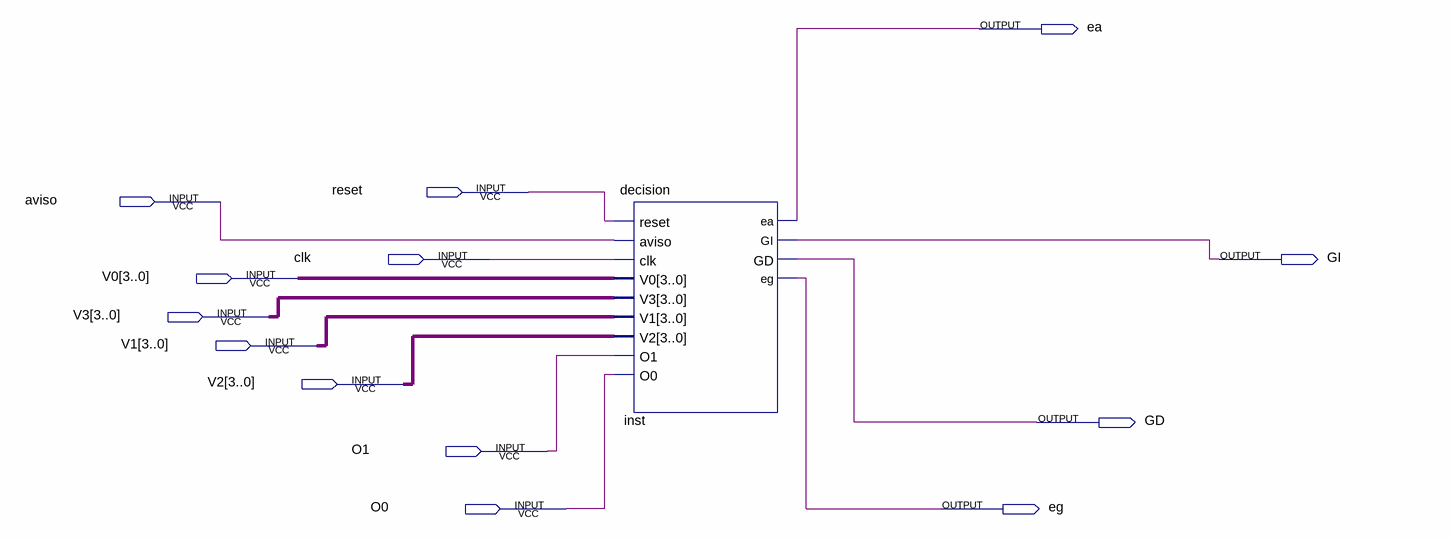
[diagram p0: schematic sheet]
// Quartus schematic decisionfinal.bdf as structural Verilog: 1 symbols, 13 pins
module decisionfinal (
  input  reset,
  input  aviso,
  input  clk,
  input  [3:0] V0,
  input  [3:0] V3,
  input  [3:0] V1,
  input  [3:0] V2,
  input  O1,
  input  O0,
  output ea,
  output GI,
  output GD,
  output eg
);

  decision inst (
    .reset(reset), .aviso(aviso), .clk(clk), .V0(V0), .V3(V3), .V1(V1), .V2(V2), .O1(O1), .O0(O0), .ea(ea),
    .GI(GI), .GD(GD), .eg(eg));
endmodule
